# Altium schematic sheet top.SchDoc
size A3; SheetNumber: 1; SheetTotal: 8
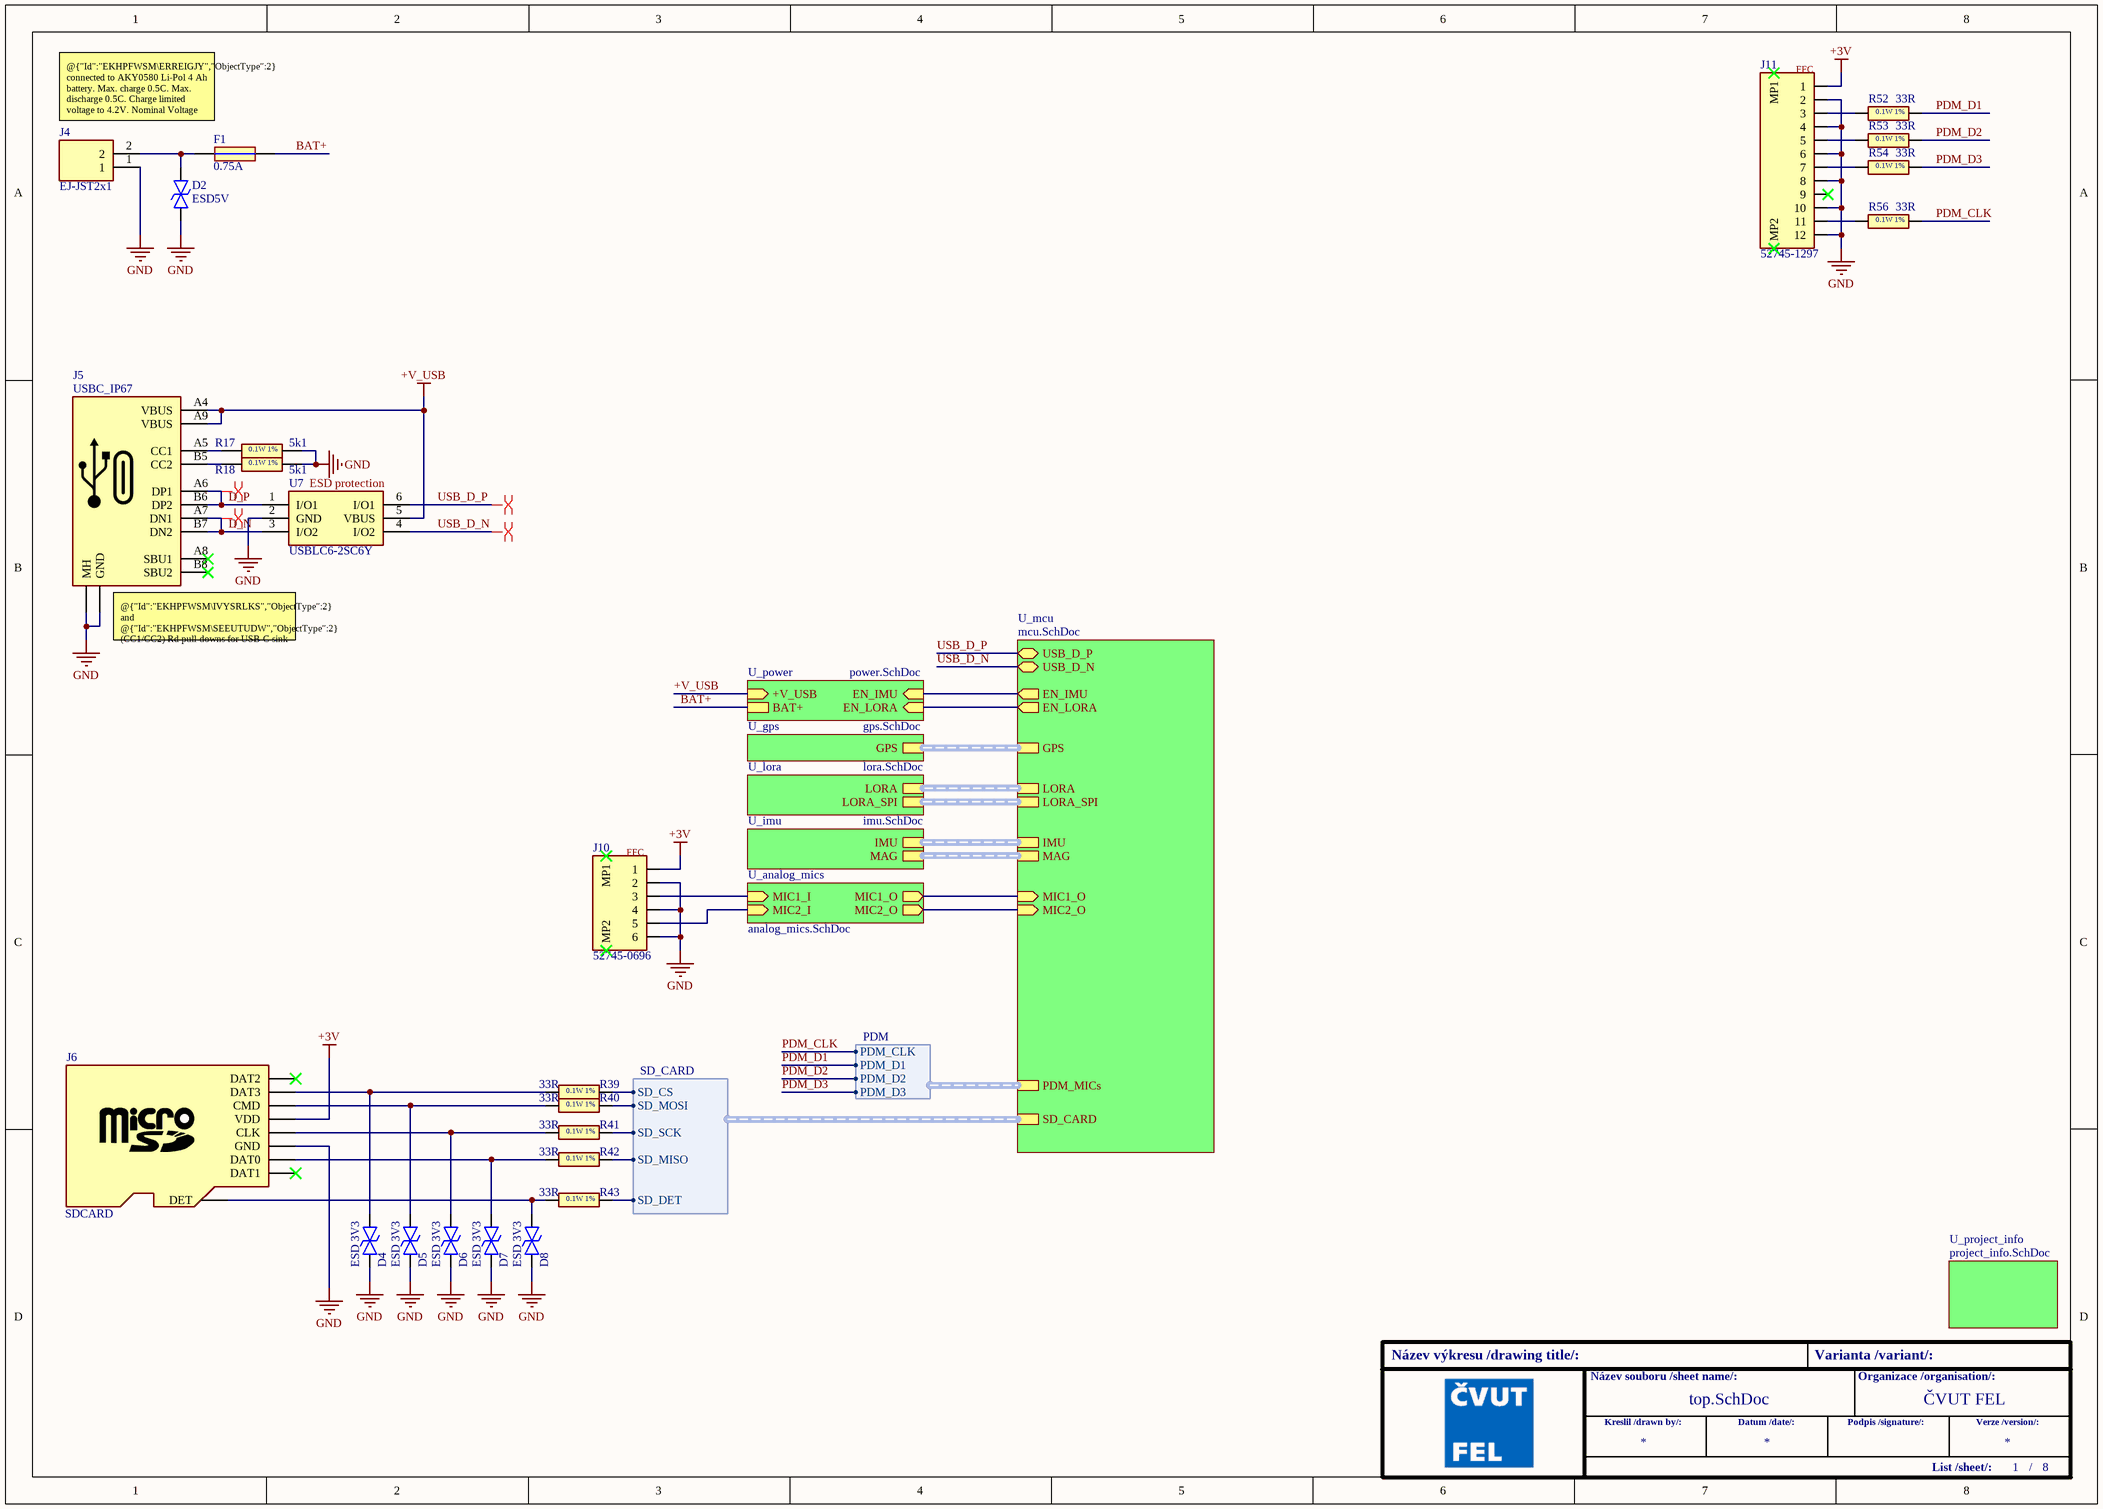
[diagram p0: top.SchDoc]

## Parts
D2  ESD5V  [SODFL1006X40N]
D4  ESD 3V3  [SODFL1006X40N]
D5  ESD 3V3  [SODFL1006X40N]
D6  ESD 3V3  [SODFL1006X40N]
D7  ESD 3V3  [SODFL1006X40N]
D8  ESD 3V3  [SODFL1006X40N]
F1  0.75A  [PTS120630V012]
J4  EJ-JST2x1  [S2BZRLFSN]
J5  USBC_IP67  [USB472003A]
J6  SDCARD  [1051620001]
J10  52745-0696  [527450696]
J11  52745-1297  [527451297]
R17  5k1  [RESC1608X55N]
R18  5k1  [RESC1608X55N]
R39  33R  [RESC1608X55N]
R40  33R  [RESC1608X55N]
R41  33R  [RESC1608X55N]
R42  33R  [RESC1608X55N]
R43  33R  [RESC1608X55N]
R52  33R  [RESC1608X55N]
R53  33R  [RESC1608X55N]
R54  33R  [RESC1608X55N]
R56  33R  [RESC1608X55N]
U7  USBLC6-2SC6Y  [SOT95P280X145-6N]

## Sub-sheets
U_analog_mics = analog_mics.SchDoc: MIC1_I (in), MIC2_I (in), MIC1_O (out), MIC2_O (out)
U_gps = gps.SchDoc: GPS (harness GPS)
U_imu = imu.SchDoc: MAG (harness MAG), IMU (harness IMU)
U_lora = lora.SchDoc: LORA_SPI (harness SPI), LORA (harness EBYTE22)
U_mcu = mcu.SchDoc: SD_CARD (harness SD_CARD), PDM_MICs (harness PDM), USB_D_P (bidir), USB_D_N (bidir), EN_IMU (out), EN_LORA (out), GPS (harness GPS), LORA (harness EBYTE22), LORA_SPI (harness SPI), IMU (harness IMU), MAG (harness MAG), MIC1_O (in), MIC2_O (in)
U_power = power.SchDoc: BAT+, EN_LORA (in), EN_IMU (in), +V_USB (in)
U_project_info = project_info.SchDoc: no entries

## Harnesses
SD_CARD: SD_CS, SD_MOSI, SD_SCK, SD_MISO, SD_DET
PDM: PDM_D3, PDM_D2, PDM_D1, PDM_CLK

## Nets
+3V: J6.4(VDD) J10.1 J11.1
+V_USB: J5.A4(VBUS) J5.A9(VBUS) U7.5(VBUS) ; sheet U_power/+V_USB
GND: D2.1 D4.1 D5.1 D6.1 D7.1 D8.1 J4.1 J5.A12(GND) J5.MH1(MH) J6.10(GND) J10.2 J10.4 J10.6 J11.2 J11.4 J11.6 J11.8 J11.10 J11.12 R17.2 R18.2 U7.2(GND)
BAT+: F1.2 ; sheet U_power/BAT+
D_N: J5.A7(DN1) J5.B7(DN2) U7.3(I/O2)
D_P: J5.A6(DP1) J5.B6(DP2) U7.1(I/O1)
PDM_CLK: R56.2 ; sheet U_mcu/PDM_MICs.PDM_CLK
PDM_D1: R52.2 ; sheet U_mcu/PDM_MICs.PDM_D1
PDM_D2: R53.2 ; sheet U_mcu/PDM_MICs.PDM_D2
PDM_D3: R54.2 ; sheet U_mcu/PDM_MICs.PDM_D3
USB_D_N: U7.4(I/O2) ; sheet U_mcu/USB_D_N
USB_D_P: U7.6(I/O1) ; sheet U_mcu/USB_D_P
NetD2_2: D2.2 F1.1 J4.2
NetD4_2: D4.2 J6.2(DAT3) R39.1
NetD5_2: D5.2 J6.3(CMD) R40.1
NetD6_2: D6.2 J6.5(CLK) R41.1
NetD7_2: D7.2 J6.7(DAT0) R42.1
NetD8_2: D8.2 J6.9(DET) R43.1
NetJ5_A5: J5.A5(CC1) R17.1
NetJ5_B5: J5.B5(CC2) R18.1
NetJ10_3: J10.3 ; sheet U_analog_mics/MIC1_I
NetJ10_5: J10.5 ; sheet U_analog_mics/MIC2_I
NetJ11_3: J11.3 R52.1
NetJ11_5: J11.5 R53.1
NetJ11_7: J11.7 R54.1
NetJ11_11: J11.11 R56.1
NetR39_2: R39.2 ; sheet U_mcu/SD_CARD.SD_CS
NetR40_2: R40.2 ; sheet U_mcu/SD_CARD.SD_MOSI
NetR41_2: R41.2 ; sheet U_mcu/SD_CARD.SD_SCK
NetR42_2: R42.2 ; sheet U_mcu/SD_CARD.SD_MISO
NetR43_2: R43.2 ; sheet U_mcu/SD_CARD.SD_DET
(unnamed): sheet U_power/EN_LORA, sheet U_mcu/EN_LORA
(unnamed): sheet U_power/EN_IMU, sheet U_mcu/EN_IMU
(unnamed): sheet U_mcu/MIC1_O, sheet U_analog_mics/MIC1_O
(unnamed): sheet U_mcu/MIC2_O, sheet U_analog_mics/MIC2_O

Not connected (* = marked no-connect by the designer): J5 A8(SBU1)* B8(SBU2)*; J6 1(DAT2)* 8(DAT1)*; J10 7(MP1)* 8(MP2)*; J11 9* MP1* MP2*

## Buses and harness runs
harness sheet U_gps/GPS = sheet U_mcu/GPS
harness sheet U_imu/IMU = sheet U_mcu/IMU
harness sheet U_imu/MAG = sheet U_mcu/MAG
harness sheet U_lora/LORA = sheet U_mcu/LORA
harness sheet U_lora/LORA_SPI = sheet U_mcu/LORA_SPI

## Layout directives
differential pair; differential pair class USB: D_N, D_P, USB_D_N, USB_D_P

## Notes on the sheet
- (near J11) FFC
- @{"Id":"EKHPFWSM\ERREIGJY","ObjectType":2} connected to AKY0580 Li-Pol 4 Ah battery. Max. charge 0.5C. Max. discharge 0.5C. Charge limited voltage to 4.2V. Nominal Voltage 3.7V.
- (near U7) ESD protection
- (near J5) @{"Id":"EKHPFWSM\IVYSRLKS","ObjectType":2} and @{"Id":"EKHPFWSM\SEEUTUDW","ObjectType":2} (CC1/CC2) Rd pull-downs for USB-C sink detection. USB2.0 = 500mA; USB3.x = 900mA.
- (near J10) FFC
- Název výkresu /drawing title/:
- Název souboru /sheet name/:
- Varianta /variant/:
- Organizace /organisation/:
- ČVUT FEL
- Kreslil /drawn by/:
- Datum /date/:
- Podpis /signature/:
- List /sheet/:
- Verze /version/:
- /
- (in symbol ER+5k1) 0.1W 1%
- (in symbol ER+33R) 0.1W 1%

## Library data of the parts
D2 = ED+ESD5V: ESD Protection Diode, Bidirectional, VRWM=5 V, VBR=6 V typ., VC=14 V max, IPP=6 A, Cd=20 pF, ±30 kV ESD, SOD-923; Manufacturer_Name: Diodes Incorporated; Manufacturer_Part_Number: D5V0L1B2S9-7; Datasheet Link: https://www.diodes.com/assets/Datasheets/D5V0L1B2S9.pdf; Height: 0.4mm; Mouser Part Number: 621-D5V0L1B2S9-7; Mouser Price/Stock: https://www.mouser.co.uk/ProductDetail/Diodes-Incorporated/D5V0L1B2S9-7?qs=bLNvM6dkO6SRwc%2Fzm27P2g%3D%3D; Arrow Part Number: D5V0L1B2S9-7; Arrow Price/Stock: https://www.arrow.com/en/products/d5v0l1b2s9-7/diodes-incorporated?utm_currency=USD&region=nac
D4-D8 = ED+ESD3.3V15pF: Vesd (ESD contact/air gap): 18 kV, Cd (Diode Capacitance): 15 pF, Working Voltage: 3.3 V, Breakdown Voltage: 5 V, Clamping Voltage: 10.5 V; Manufacturer_Name: onsemi; Manufacturer_Part_Number: ESD9B3.3ST5G; Datasheet Link: https://www.onsemi.com/pub/Collateral/ESD9B-D.PDF; Height: 0.4mm; Mouser Part Number: 863-ESD9B3.3ST5G; Mouser Price/Stock: https://www.mouser.co.uk/ProductDetail/onsemi/ESD9B3.3ST5G?qs=yU2N9dt%252BrfmXrPf3vhgUEA%3D%3D; Arrow Part Number: ESD9B3.3ST5G; Arrow Price/Stock: https://www.arrow.com/en/products/esd9b3.3st5g/on-semiconductor?utm_currency=USD&region=nac
F1 = EF+0.75A6V_1206: Resettable Fuses - PPTC 1206 6V 0.75A 1.1W SMD AEC-Q200 High Temp; Manufacturer_Name: YAGEO; Manufacturer_Part_Number: SMDH1206B075TF; Datasheet Link: https://cz.mouser.com/datasheet/3/508/1/smdh1206.pdf; Mouser Part Number: 603-SMDH1206B075TF; Mouser Price/Stock: https://cz.mouser.com/ProductDetail/YAGEO/SMDH1206B075TF?qs=jcD%2FCkGBYeN0SVo4GFcQbQ%3D%3D
J4 = EJ-JST2x1: Konektor: kabel-pl.spoj; zásuvka; vidlice; PIN: 2; PH; 2A; 100V; SMT; Manufacturer_Name: JST (JAPAN SOLDERLESS TERMINALS); Manufacturer_Part_Number: S2B-ZR (LF)(SN); Datasheet Link: https://www.jst-mfg.com/product/pdf/eng/eZH.pdf?6794690f4fd86; Height: 3.7mm; Arrow Part Number: S2B-ZR (LF)(SN); Arrow Price/Stock: https://www.arrow.com/en/products/s2b-zr-lf-sn/jst-manufacturing?region=europe
J5 = EJ-USBC_IP67: USB Connectors USB2.0 TypeC Recpt., 3u Gold, 16P Horz Mid Mount SMT, 1.13mm O-set, IP67; pin to pad: A1, A12>A12+A1 A12>A12+A1 MH>MH1+MH2+MH3+MH4+MH5+MH6; Manufacturer_Name: GCT (GLOBAL CONNECTOR TECHNOLOGY); Manufacturer_Part_Number: USB4720-03-A; Datasheet Link: https://www.gct.co/files/drawings/USB4720.pdf; Height: 3.9mm; Mouser Part Number: 640-USB472003A; Mouser Price/Stock: https://www.mouser.co.uk/ProductDetail/GCT/USB4720-03-A?qs=Z%252BL2brAPG1IK%252BbxHmYg8zQ%3D%3D
J6 = EMECH+SDCARD: Memory Card Connectors Micro SD Push Pull SMT 1.15mm; pin to pad: 10>6+10+11+12+13; Manufacturer_Name: Molex; Manufacturer_Part_Number: 105162-0001; Datasheet Link: http://www.molex.com/webdocs/datasheets/pdf/en-us//1051620001_MEMORY_CARD_SOCKET.pdf; Height: 1.45mm; Mouser Part Number: 538-105162-0001; Mouser Price/Stock: https://www.mouser.co.uk/ProductDetail/Molex/105162-0001?qs=1fNsfHe5VsK8daqlgKxZfQ%3D%3D
J10 = EJ+52745-0696: FFC & FPC Connectors RA SMT ZIF TOP 6P ROHS COMPLIANT, Pitch: 0.5 mm, Mounting Angle / Contact Location: Right Angle / Top Contact, Current Rating: 500 mA, Voltage Rating: 50 V; Manufacturer_Name: Molex; Datasheet Link: https://www.molex.com/content/dam/molex/molex-dot-com/products/automated/en-us/salesdrawingpdf/527/52745/527450696_sd.pdf?inline; Height: 2.2mm; Manufacturer_Part_Number: 52745-0696; Mouser Part Number: 538-52745-0696; Mouser Price/Stock: https://www.mouser.co.uk/ProductDetail/Molex/52745-0696?qs=AU9XQWArEY9ei7I32bfdLw%3D%3D
J11 = EJ+52745-1297: FFC & FPC Connectors RA SMT ZIF TOP 12P GOLD, Pitch: 0.5 mm, Mounting Angle / Contact Location: Right Angle / Top Contact, Current Rating: 500 mA, Voltage Rating: 50 V; Manufacturer_Name: Molex; Datasheet Link: https://www.molex.com/pdm_docs/sd/527451297_sd.pdf; Height: 2mm; Manufacturer_Part_Number: 52745-1297; Mouser Part Number: 538-52745-1297; Mouser Price/Stock: https://www.mouser.co.uk/ProductDetail/Molex/52745-1297?qs=nDwhpid8gJaCgIkitRUygg%3D%3D
R17 R18 = ER+5k1: Thick Film Resistors - SMD 1/10Watt 5.1Kohms 1%; Manufacturer_Name: Vishay; Manufacturer_Part_Number: CRCW06035K10FKEBC; Datasheet Link: https://www.vishay.com/docs/28773/crcwce3.pdf; Height: 0.55mm; Mouser Part Number: 71-CRCW06035K10FKEBC; Mouser Price/Stock: https://www.mouser.co.uk/ProductDetail/Vishay-Dale/CRCW06035K10FKEBC?qs=wd5RIQLrsJiajonkePuzqw%3D%3D; Arrow Part Number: CRCW06035K10FKEBC; Arrow Price/Stock: https://www.arrow.com/en/products/crcw06035k10fkebc/vishay?region=nac
R39-R43 R52-R54 R56 = ER+33R: Resistor 1% 0.1W; Manufacturer_Name: ROYALOHM; Manufacturer_Part_Number: 0603WAF330JT5E; Datasheet Link: https://datasheet.lcsc.com/lcsc/2206010116_UNI-ROYAL-Uniroyal-Elec-0603WAF330JT5E_C23140.pdf; Height: 0.55mm; Mouser Part Number: 303-0603WAF330JT5E; Mouser Price/Stock: https://www.mouser.co.uk/ProductDetail/Royalohm/0603WAF330JT5E?qs=e8oIoAS2J1RitKiKgULsBA%3D%3D
U7 = EU+ESDUSBLC6: Low Cap. ESD Protection Auto SOT-23-6 STMicroelectronics USBLC6-2SC6Y, Dual Uni-Directional TVS Diode Array, 6-Pin SOT-23; Geometry.Height: 1.45mm; Manufacturer_Name: STMicroelectronics; Manufacturer_Part_Number: USBLC6-2SC6Y; Mouser Part Number: 511-USBLC6-2SC6Y; Mouser Price/Stock: https://www.mouser.co.uk/ProductDetail/STMicroelectronics/USBLC6-2SC6Y?qs=gNDSiZmRJS%2FOgDexvXkdow%3D%3D; Arrow Part Number: USBLC6-2SC6Y; Arrow Price/Stock: https://www.arrow.com/en/products/usblc6-2sc6y/stmicroelectronics.html?utm_currency=USD&region=nac; Datasheet Link: https://www.st.com/resource/en/datasheet/usblc6-2sc6y.pdf